# Altium schematic sheet Power_DCDC.SchDoc
size A4; CompanyName: TH Nürnberg; Address1: Kesslerplatz 12; Address2: 90489 Nürnberg; Address3: GERMANY; SheetNumber: 10; SheetTotal: 10
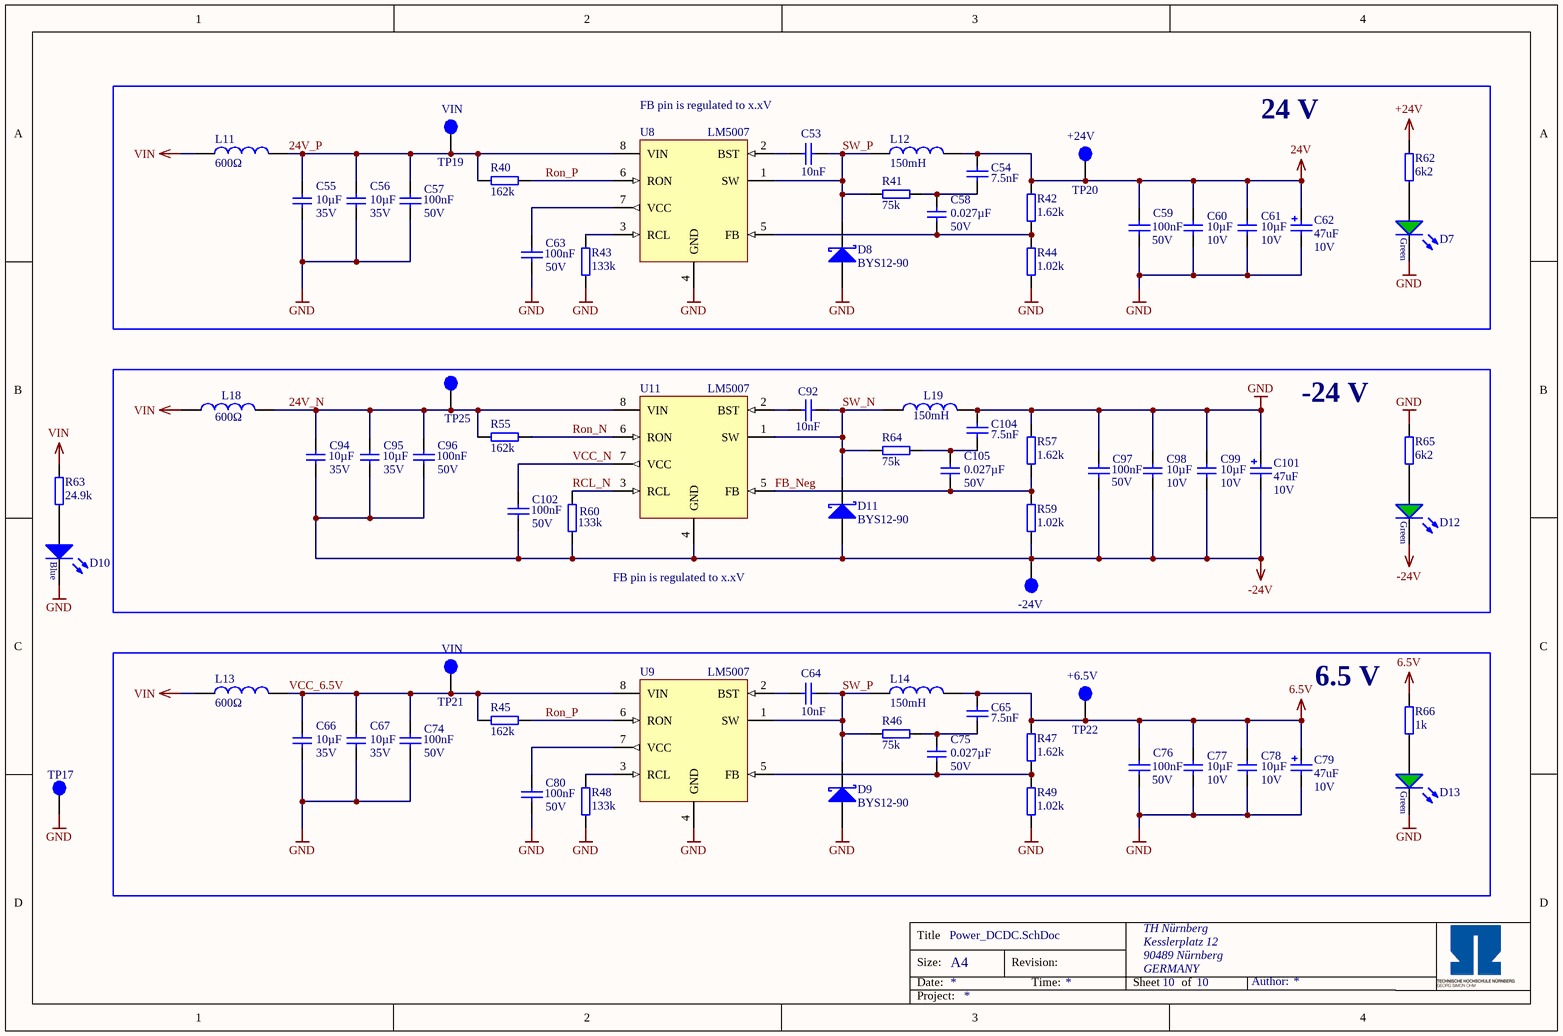
[diagram p0: Power_DCDC.SchDoc]

## Parts
-24V  -6.5V  [TP_1mm]  (value not drawn)  (no BOM)
C53  10nF  [CAPC1608X07N]
C54  7.5nF  [CAPC1608X07N]
C55  10µF  Voltage: 35V  [C_1206]
C56  10µF  Voltage: 35V  [C_1206]
C57  100nF  Voltage: 50V  [CAPC1608X07N]
C58  0.027µF  Voltage: 50V  [C_1206]
C59  100nF  Voltage: 50V  [CAPC1608X07N]
C60  10µF  Voltage: 10V  [C_1206]
C61  10µF  Voltage: 10V  [C_1206]
C62  47uF  Voltage: 10V  [WCAP-ASLI_5x5.5]
C63  100nF  Voltage: 50V  [CAPC1608X07N]
C64  10nF  [CAPC1608X07N]
C65  7.5nF  [CAPC1608X07N]
C66  10µF  Voltage: 35V  [C_1206]
C67  10µF  Voltage: 35V  [C_1206]
C74  100nF  Voltage: 50V  [CAPC1608X07N]
C75  0.027µF  Voltage: 50V  [C_1206]
C76  100nF  Voltage: 50V  [CAPC1608X07N]
C77  10µF  Voltage: 10V  [C_1206]
C78  10µF  Voltage: 10V  [C_1206]
C79  47uF  Voltage: 10V  [WCAP-ASLI_5x5.5]
C80  100nF  Voltage: 50V  [CAPC1608X07N]
C92  10nF  [CAPC1608X07N]
C94  10µF  Voltage: 35V  [C_1206]
C95  10µF  Voltage: 35V  [C_1206]
C96  100nF  Voltage: 50V  [CAPC1608X07N]
C97  100nF  Voltage: 50V  [CAPC1608X07N]
C98  10µF  Voltage: 10V  [C_1206]
C99  10µF  Voltage: 10V  [C_1206]
C101  47uF  Voltage: 10V  [WCAP-ASLI_5x5.5]
C102  100nF  Voltage: 50V  [CAPC1608X07N]
C104  7.5nF  [CAPC1608X07N]
C105  0.027µF  Voltage: 50V  [C_1206]
D7  150060GS75000  [WL-SMCW_0603]  (value not drawn)
D8  BYS12-90  [DIOM4227X23N]
D9  BYS12-90  [DIOM4227X23N]
D10  150060BS75000  [WL-SMCW_0603]  (value not drawn)
D11  BYS12-90  [DIOM4227X23N]
D12  150060GS75000  [WL-SMCW_0603]  (value not drawn)
D13  150060GS75000  [WL-SMCW_0603]  (value not drawn)
L11  600Ω  [WE-CBF_0805_High Current]
L12  150mH  [SMT_inductor_1050_Performance]
L13  600Ω  [WE-CBF_0805_High Current]
L14  150mH  [SMT_inductor_1050_Performance]
L18  600Ω  [WE-CBF_0805_High Current]
L19  150mH  [SMT_inductor_1050_Performance]
R40  162k  [RESC1608X06N]
R41  75k  [RESC1608X06N]
R42  1.62k  [RESC1608X06N]
R43  133k  [RESC1608X06N]
R44  1.02k  [RESC1608X06N]
R45  162k  [RESC1608X06N]
R46  75k  [RESC1608X06N]
R47  1.62k  [RESC1608X06N]
R48  133k  [RESC1608X06N]
R49  1.02k  [RESC1608X06N]
R55  162k  [RESC1608X06N]
R57  1.62k  [RESC1608X06N]
R59  1.02k  [RESC1608X06N]
R60  133k  [RESC1608X06N]
R62  6k2  [RES 0603_1608]
R63  24.9k  [RESC1608X06N]
R64  75k  [RESC1608X06N]
R65  6k2  [RES 0603_1608]
R66  1k  [RES 0603_1608]
TP17  GND  [TP_1mm]  (value not drawn)  (no BOM)
TP19  VIN  [TP_1mm]  (no BOM)
TP20  +24V  [TP_1mm]  (no BOM)
TP21  VIN  [TP_1mm]  (no BOM)
TP22  +6.5V  [TP_1mm]  (no BOM)
TP25  VIN  [TP_1mm]  (value not drawn)  (no BOM)
U8  LM5007  [TSOP65P490X110-8N]
U9  LM5007  [TSOP65P490X110-8N]
U11  LM5007  [TSOP65P490X110-8N]

## Blocks framed on the sheet
24 V: C53-C63 D7 D8 L11 L12 R40-R44 R62 TP19 TP20 U8
-24 V: -24V C92 C94-C99 C101 C102 C104 C105 D11 D12 L18 L19 R55 R57 R59 R60 R64 R65 TP25 U11
6.5 V: C64-C67 C74-C80 D9 D13 L13 L14 R45-R49 R66 TP21 TP22 U9

## Nets
6.5V: C65.1 C76.2 C77.2 C78.2 C79.2(P) L14.2 R47.2 R66.2 TP22.1
24V: C54.1 C59.2 C60.2 C61.2 C62.2(P) L12.2 R42.2 TP20.1
+24V: R62.2
-24V: -24V.1 C94.1 C95.1 C96.2 C97.1 C98.1 C99.1 C101.1(N) C102.2 D11.2(A) D12.1(K) R59.2 R60.1 U11.4(GND)
GND: C55.1 C56.1 C57.2 C59.1 C60.1 C61.1 C62.1(N) C63.2 C66.1 C67.1 C74.2 C76.1 C77.1 C78.1 C79.1(N) C80.2 C97.2 C98.2 C99.2 C101.2(P) C104.1 D7.1(K) D8.2(A) D9.2(A) D10.1(K) D13.1(K) L19.2 R43.1 R44.1 R48.1 R49.1 R57.1 R65.2 TP17.1 U8.4(GND) U9.4(GND)
VIN: L11.1 L13.1 L18.1 R63.2
24V_N: C94.2 C95.2 C96.1 L18.2 R55.2 TP25.1 U11.8(VIN)
24V_P: C55.2 C56.2 C57.1 L11.2 R40.1 TP19.1 U8.8(VIN)
FB_Neg: C105.1 R57.2 R59.1 U11.5(FB)
RCL_N: R60.2 U11.3(RCL)
Ron_N: R55.1 U11.6(RON)
Ron_P: R40.2 R45.2 U8.6(RON) U9.6(RON)
SW_N: C92.1 D11.1(K) L19.1 R64.1 U11.1(SW)
SW_P: C53.2 C64.2 D8.1(K) D9.1(K) L12.1 L14.1 R41.1 R46.1 U8.1(SW) U9.1(SW)
VCC_6.5V: C66.2 C67.2 C74.1 L13.2 R45.1 TP21.1 U9.8(VIN)
VCC_N: C102.1 U11.7(VCC)
NetC53_1: C53.1 U8.2(BST)
NetC54_2: C54.2 C58.2 R41.2
NetC58_1: C58.1 R42.1 R44.2 U8.5(FB)
NetC63_1: C63.1 U8.7(VCC)
NetC64_1: C64.1 U9.2(BST)
NetC65_2: C65.2 C75.2 R46.2
NetC75_1: C75.1 R47.1 R49.2 U9.5(FB)
NetC80_1: C80.1 U9.7(VCC)
NetC92_2: C92.2 U11.2(BST)
NetC104_2: C104.2 C105.2 R64.2
NetD7_2: D7.2(A) R62.1
NetD10_2: D10.2(A) R63.1
NetD12_2: D12.2(A) R65.1
NetD13_2: D13.2(A) R66.1
NetR43_2: R43.2 U8.3(RCL)
NetR48_2: R48.2 U9.3(RCL)

## Notes on the sheet
- FB pin is regulated to x.xV
- Title
- Size:
- Date:
- A4
- Revision:
- Time:
- Sheet
- of
- Author:
- Project:

## Library data of the parts
-24V TP17 TP19-TP22 TP25 = TP_1mm: Testpoint 1mm; Created: 2018_06_25_AGeiger; Value: Testpoint 1mm
C53 C64 = Cap_0603: MPN: 885012206065; MF: Würth; Voltage: 25V; Dielectric: X7R; Value: 10nF; Supplier 1: Mouser; Supplier 2: *; Supplier Part Number 1: 710-885012206065; Supplier Part Number 2: *; Package: 0603
C54 C65 C104 = Cap_0603: MPN: C0603C752J3GACTU; MF: KEMET; Voltage: 25V; Dielectric: C0G; Value: 7.5nF; Supplier 1: Mouser; Supplier 2: *; Supplier Part Number 1: 80-C0603C752J3GACTU; Supplier Part Number 2: *; Package: 0603
C55 C56 C66 C67 C94 C95 = C_1206: Capacitor 1206; MPN: 1206DD106MAT2A; Tolerance: 20%; MF: AVX; Dielectric: X5R; Package: 1206; Value: 10µF; Supplier 1: Mouser; Supplier Part Number 1: 581-1206DD106MAT2A
C57 C63 C74 C80 C96 C97 C102 = Cap_0603: MPN: CC0603KRX7R9BB104; MF: Yageo; Tolerance: 10%; Dielectric: X5R; Value: 100nF; Supplier 1: Mouser; Supplier 2: Mouser; Supplier Part Number 1: 603-CC603KRX7R9BB104; Supplier Part Number 2: 710-885382206004; Package: 0603
C58 C75 C105 = C_1206: Capacitor 1206; MPN: GRM3195C1H273JA01D; Tolerance: 5%; MF: Murata; Dielectric: C0G; Package: 1206; Value: 0.027µF; Created: 2018_06_25_AGeiger; Supplier 1: Mouser; Supplier Part Number 1: 81-GRM315C1H273JA01D
C59 C76 = Cap_0603: MPN: CC0603KRX7R9BB104; MF: Yageo; Dielectric: X5R; Value: 100nF; Supplier 1: Mouser; Supplier 2: Mouser; Supplier Part Number 1: 603-CC603KRX7R9BB104; Supplier Part Number 2: 710-885382206004; Package: 0603
C60 C61 C77 C78 C98 C99 = C_1206: Capacitor 1206; MPN: CL31A106KPHNNNE; Tolerance: 10%; MF: Samsung Electro-Mechanics; Dielectric: X5R; Package: 1206; Value: 10µF; Created: 2020_09_17_Liegmann; Supplier 1: Mouser; Supplier Part Number 1: 187-CL31A106KPHNNNE
C62 C79 C101 = 865080142007: WCAP-ASLI Aluminum Electrolytic Capacitor, V-Chip, SMT, D5xH5.5mm, 47uF, 10V; MPN: 865080242004; Dissipation Factor: 24%; Endurance: 2000h; Leakage Current: 6.3uA; MF: Wurth Elektronik; Ripple Current: 170mA; Capacitance Tolerance: +/-20%; Technical Reference: ASEC055101M6R3DVCTBB000; ComponentLink1Description: Manufacturer; ComponentLink1URL: http://www.we-online.de; ComponentLink2Description: Datasheet; ComponentLink2URL: https://www.we-online.com/catalog/datasheet/865080142007.pdf; Height: 5.5mm; Mounting Technology: SMT; Operating Temperature: -55 to +105degC; Packaging: Tape and Reel; Published Date: May 2020; Diameter: 5mm; Supplier 1: Mouser; Supplier Part Number 1: 710-865080242004; Value: 47uF
C92 = Cap_0603: MPN: 885012206065; MF: Würth Elektronik; Voltage: 25V; Dielectric: X7R; Value: 10nF; Supplier 1: Mouser; Supplier 2: Digi-Key; Supplier Part Number 1: 710-885012206065; Supplier Part Number 2: 732-7983-1-ND; Package: 0603
D7 D12 D13 = LED_Green_0603: WL-SMCW SMD Mono-color Chip LED Waterclear, size 0603, Green, 3.2 V, 140°; Forward Voltage: 3.2 V; Luminous Intensity: 430 mcd; Peak Wavelength: 515 nm; Dominant Wavelength: 520 nm; MF: Wuerth Elektronik; Published Date: Sep. 2017; ComponentLink1Description: Manufacturer; ComponentLink1URL: http://www.we-online.de; ComponentLink2Description: Datasheet; ComponentLink2URL: http://katalog.we-online.com/led/datasheet/150060GS75000.pdf; MPN: 150060GS75000; Size: 0603; Viewing Angle: 140°; Emitting Color: Green; Value: 150060GS75000; Package: 0603; Created: 2018_09_06_AGeiger; Supplier 1: Farnell; Supplier Part Number 1: 2322070; Supplier 2: Mouser; Supplier Part Number 2: 710-150060GS75000; Supplier 3: Digi-Key; Supplier Part Number 3: 732-4971-1-ND
D8 D9 D11 = BYS12-90: Schottky Diode; MPN: BYS12-90-E3/TR3; MF: Vishay; Forward Voltage: 750mV; Reverse Voltage: 90V; Rated Current: 1.5A; Package: DO-214AC; Supplier 1: Farnell; Supplier 2: Mouser; Supplier 3: Digi-Key; Supplier Part Number 1: 2889144; Supplier Part Number 2: 625-BYS12-90-E3/TR3; Supplier Part Number 3: BYS12-90-E3/GICT-ND; ComponentLink1Description: Manufacturer; ComponentLink1URL: https://www.vishay.com/; ComponentLink2Description: Datasheet; ComponentLink2URL: https://www.vishay.com/docs/88950/bys12-90.pdf
D10 = LED_Blue_0603: WL-SMCW SMD Mono-color Chip LED Waterclear, size 0603, Blue, 3.2 V, 140°; Forward Voltage: 3.2 V; Luminous Intensity: 145 mcd; Peak Wavelength: 465 nm; Dominant Wavelength: 470 nm; MF: Wuerth Elektronik; Published Date: Sep. 2017; ComponentLink1Description: Manufacturer; ComponentLink1URL: http://www.we-online.de; ComponentLink2Description: Datasheet; ComponentLink2URL: http://katalog.we-online.com/led/datasheet/150060BS75000.pdf; MPN: 150060BS75000; Size: 0603; Viewing Angle: 140°; Emitting Color: Blue; Value: 150060BS75000; Package: 0603; Created: 2018_09_06_AGeiger; Supplier 1: Farnell; Supplier Part Number 1: 2322069; Supplier 2: Mouser; Supplier Part Number 2: 710-150060BS75000; Supplier 3: Digi-Key; Supplier Part Number 3: 732-4966-1-ND
L11 L13 = WE-CBF, 742792040: WE-CBF SMD EMI Suppression Ferrite Bead, 0805, 600Ω; MF: Wurth Elektronik; Type: High Current; PublishedDate: Aug 2016; ComponentLink1Description: Manufacturer; ComponentLink1URL: http://www.we-online.de; ComponentLink2Description: Datasheet; ComponentLink2URL: http://katalog.we-online.de/pbs/datasheet/742792040.pdf; MPN: 742792040; Value: 600Ω; Size: 0805; Supplier 1: Farnell; Supplier 2: Mouser; Supplier 3: Digi-Key; Supplier Part Number 1: 2761567; Supplier Part Number 2: 710-742792040; Supplier Part Number 3: 732-1620-1-ND
L12 L14 L19 = B82464G4154M: SMT power Inductor, 150uH, 320m DRC; MF: EPCOS / TDK; Rated Current: 0.85 A; MPN: B82464G4154M; Supplier 1: Mouser; Supplier Part Number 1: 871-B82464G4154M; Value: 150mH; DCR: 320m; ComponentLink1Description: Manufacturer; ComponentLink1URL: https://www.tdk-electronics.tdk.com/de; ComponentLink2Description: Datasheet; ComponentLink2URL: https://www.tdk-electronics.tdk.com/inf/30/db/ind_2008/b82464g4.pdf
L18 = WE-CBF, 742792040: WE-CBF SMD EMI Suppression Ferrite Bead, 0805, 600Ω; MF: Würth Elektronik; Type: High Current; ComponentLink1Description: Manufacturer; ComponentLink1URL: http://www.we-online.de; ComponentLink2Description: Datasheet; ComponentLink2URL: http://katalog.we-online.de/pbs/datasheet/742792040.pdf; MPN: 742792040; Value: 600Ω; Size: 0805; Supplier 1: Farnell; Supplier 2: Mouser; Supplier 3: Digi-Key; Supplier Part Number 1: 1635735; Supplier Part Number 2: 710-742792040; Supplier Part Number 3: 732-1620-1-ND
R40 R45 R55 = R_0603: MPN: CR0603-FX-1623ELF; MF: Bourns; Value: 162k; Supplier 1: Mouser; Supplier Part Number 1: 652-CR0603-FX1623ELF; Package: 0603
R41 R46 R64 = R_0603: MPN: AC0603FR-1375KL; MF: Yageo; Value: 75k; Supplier 1: Mouser; Supplier Part Number 1: 603-AC0603FR-1375KL; Package: 0603
R42 R47 R57 = R_0603: MPN: CR0603-FX-1621ELF; MF: Bourns; Tolerance: 1%; Value: 1.62k; Supplier 1: Mouser; Supplier Part Number 1: 652-CR0603FX-1621ELF; Package: 0603
R43 R48 R60 = R_0603: MPN: CR0603-FX-1333ELF; MF: Bourns; Value: 133k; Supplier 1: Mouser; Supplier Part Number 1: 652-CR0603FX-1333ELF; Package: 0603
R44 R49 R59 = R_0603: MPN: CR0603-FX-1021ELF; MF: Bourns; Tolerance: 1%; Value: 1.02k; Supplier 1: Mouser; Supplier Part Number 1: 652-CR0603FX-1021ELF; Package: 0603
R62 R65 = RK73B1JTTD622J: SMD resistor E24 series; Manufacturer: KOA Speer; Tolerance: 5%; Created from: MGremer; Manufacturer Part Number: RK73B1JTTD622J; PartID: 93; Created On: 14.12.2020 16:17:14; ComponentLink1Description: Datasheet; ComponentLink1URL: https://www.mouser.de/datasheet/2/219/RK73B-1825463.pdf; Component Type: SMD resistor; Device Package: 0603; Last Updated: 02.03.2021 14:07:32; Mounting Type: SMD; Supplier 1: Mouser; Supplier Part Number 1: 660-RK73B1JTTD622J; Type: Resistor; Value: 6k2; Live Cycle Status: 1; Stock number: Labor SMD Container
R63 = R_0603: MPN: CRCW060324K9FKEAC; MF: Vishay / Dale; Value: 24.9k; Supplier 1: Mouser; Supplier Part Number 1: 71-CRCW060324K9FKEAC; Package: 0603
R66 = RK73B1JTTDD102J: SMD resistor E24 series; Manufacturer: KOA Speer; Tolerance: 5%; Created from: MGremer; Manufacturer Part Number: RK73B1JTTDD102J; PartID: 74; Created On: 14.12.2020 16:17:14; ComponentLink1Description: Datasheet; ComponentLink1URL: https://www.mouser.de/datasheet/2/219/RK73B-1825463.pdf; Component Type: SMD resistor; Device Package: 0603; Last Updated: 02.03.2021 14:07:32; Mounting Type: SMD; Supplier 1: Mouser; Supplier Part Number 1: 660-RK73B1JTTDD102J; Type: Resistor; Value: 1k; Live Cycle Status: 1; Stock number: Labor SMD Container
U8 U9 U11 = LM5007: Buck Converter, 9-75Vin, 2.5-73Vout; MPN: LM5007MM/NOPB; MF: Texas Instruments; Supplier 1: Farnell; Supplier 2: Mouser; Supplier 3: Digi-Key; Supplier Part Number 1: 9779345; Supplier Part Number 2: 926-LM5007MM/NOPB; Supplier Part Number 3: LM5007MM/NOPBCT-ND; Package: VSSOP-8; ComponentLink1Description: Manufacturer; ComponentLink1URL: https://www.ti.com/; ComponentLink2Description: Datasheet; ComponentLink2URL: https://www.ti.com/lit/ds/symlink/lm5007.pdf?ts=1616234834930&ref_url=https%253A%252F%252Fwww.google.ru%252F